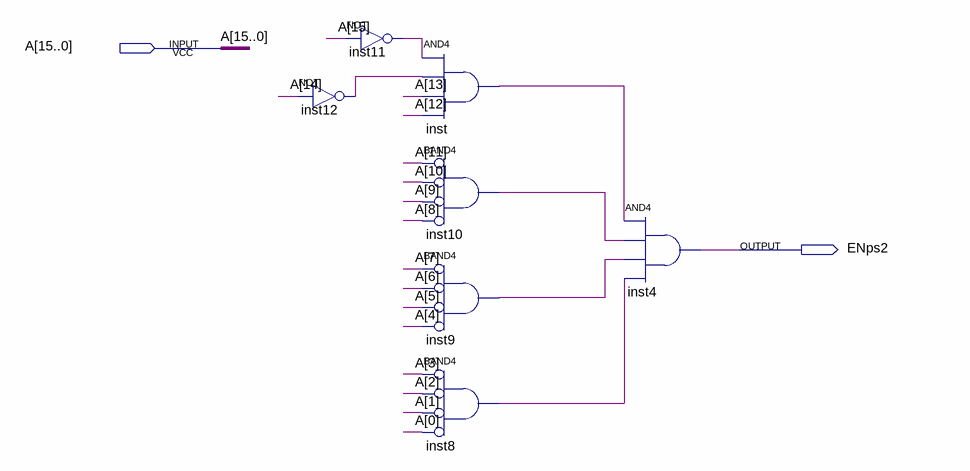
[diagram p0: schematic sheet]
// Quartus schematic CSps2.bdf as structural Verilog: 7 symbols, 2 pins
module CSps2 (
  input  [15:0] A,
  output ENps2
);

  wire inst8_out, inst9_out, inst10_out, inst11_out, inst12_out, inst_out;

  not inst12 (inst12_out, A[14]);
  not inst11 (inst11_out, A[15]);
  and inst (inst_out, inst11_out, inst12_out, A[13], A[12]);
  and inst10 (inst10_out, ~A[11], ~A[10], ~A[9], ~A[8]);  // BAND4
  and inst9 (inst9_out, ~A[7], ~A[6], ~A[5], ~A[4]);  // BAND4
  and inst8 (inst8_out, ~A[3], ~A[2], ~A[1], ~A[0]);  // BAND4
  and inst4 (ENps2, inst_out, inst10_out, inst9_out, inst8_out);
endmodule
